# Altium project tpa.PrjPcb
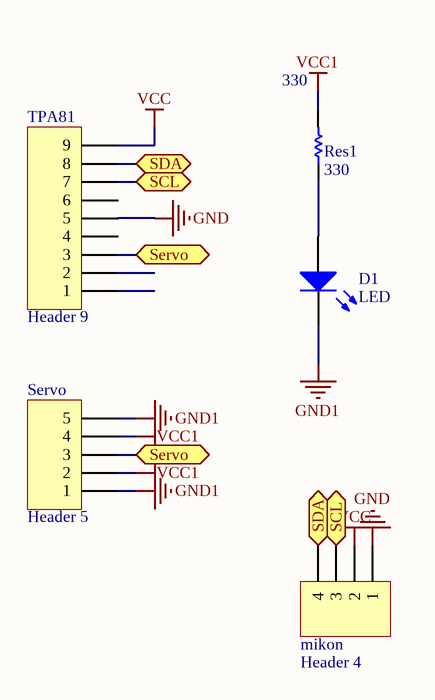
[diagram p0: tpa.SchDoc]
1 sheet, 5 parts. Net scope: flat (ports and power ports of the same name join across sheets).
Board file: tpa.PcbDoc

## Sheet tpa.SchDoc
size A

### Parts
330  Res1  value 330  [AXIAL-0.3]
D1  LED  [My_LED3MM]
mikon  Header 4  [HDR1X4]
Servo  Header 5  [HDR1X5]
TPA81  Header 9  [HDR1X9]

### Ports
SCL, SDA, Servo

### Nets
GND: mikon.1 TPA81.5
GND1: D1.K Servo.1 Servo.5
VCC: mikon.2 TPA81.9
VCC1: 330.2 Servo.2 Servo.4
Net330_1: 330.1 D1.A
Netmikon_3: mikon.3 TPA81.7 ; port SCL
Netmikon_4: mikon.4 TPA81.8 ; port SDA
NetServo_3: Servo.3 TPA81.3 ; port Servo

Not connected (* = marked no-connect by the designer): TPA81 1 2 4 6

### Library data of the parts
330 = Res1: Resistor; Published: 8-Jun-2000; LatestRevisionDate: 17-Jul-2002; LatestRevisionNote: Re-released for DXP Platform.; PackageReference: AXIAL-0.3; Publisher: Altium Limited
D1 = LED: Typical INFRARED GaAs LED; Published: 8-Jun-2000; LatestRevisionDate: 08-Jul-2005; LatestRevisionNote: Mech Layer 1 removed.; Publisher: Altium Limited
mikon = Header 4: Header, 4-Pin; LatestRevisionDate: 17-Jul-2002; LatestRevisionNote: Re-released for DXP Platform.; Publisher: Altium Limited
Servo = Header 5: Header, 5-Pin; LatestRevisionDate: 17-Jul-2002; LatestRevisionNote: Re-released for DXP Platform.; Publisher: Altium Limited
TPA81 = Header 9: Header, 9-Pin; LatestRevisionDate: 17-Jul-2002; LatestRevisionNote: Re-released for DXP Platform.; Publisher: Altium Limited